# EAGLE design robocup-switcher board (EAGLE 4.16)
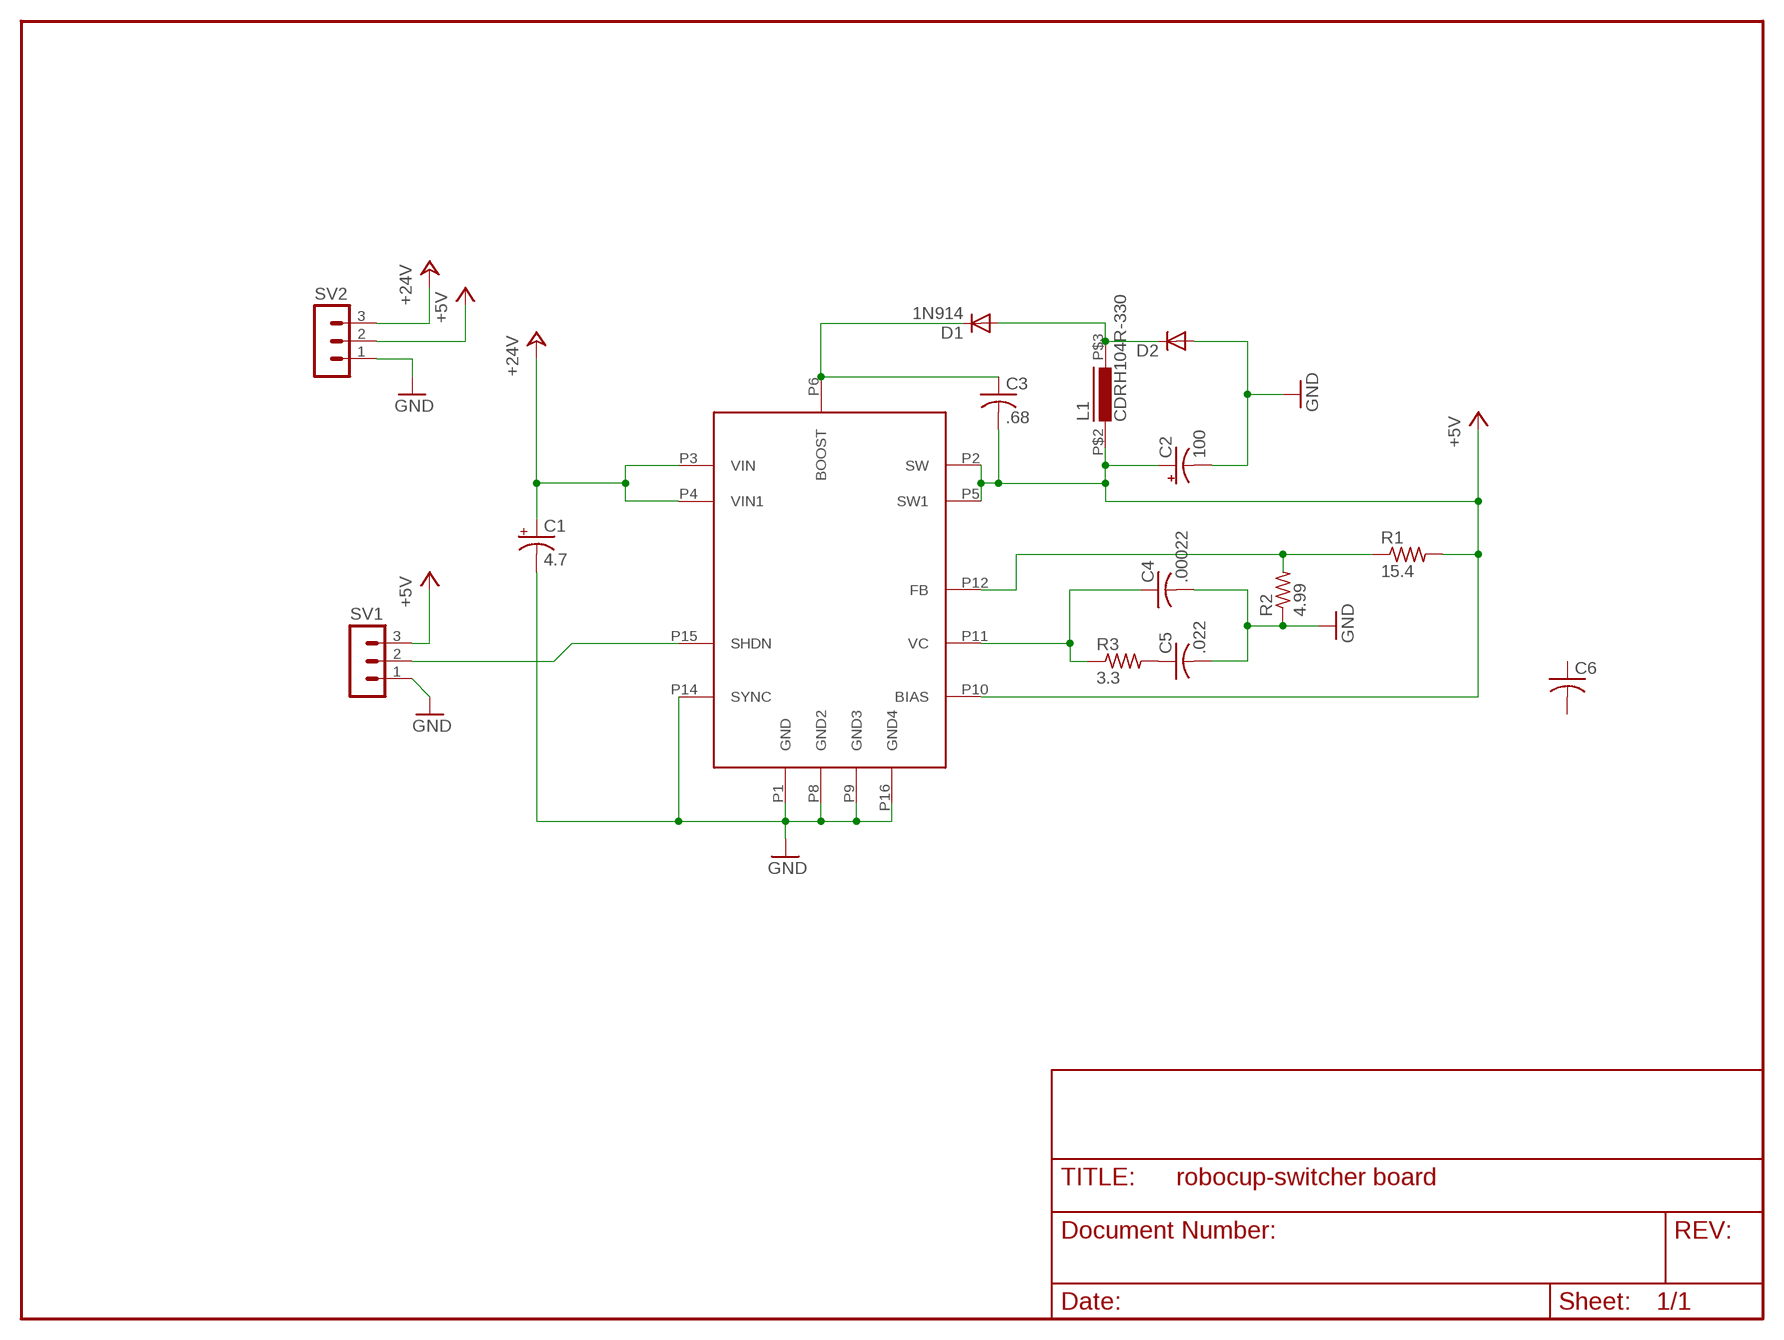
[diagram p0: schematic, sheet 1]

## Parts
C1  4.7  CPOL-USSMCD  [SMC_D]
C2  100  CPOL-USSMCD  [SMC_D]
C3  .68  C-USC0805  [C0805]
C4  .00022  C-USC0805  [C0805]
C5  .022  C-USC0805  [C0805]
C6  C-USC0805  [C0805]
D1  1N914  DIODE-MELF-MLL41  [MELF-MLL41]
D2  DIODE-SMC  [SMC]
L1  CDRH104R-330  [CDRH104]
R1  15.4  R-US_R0805  [R0805]
R2  4.99  R-US_R0805  [R0805]
R3  3.3  R-US_R0805  [R0805]
SV1  MA03-1  [MA03-1]
SV2  MA03-1  [MA03-1]
U$1  LT3430  [TSSOP16]

## Nets
+5V: C2.+ C3.2 L1.P$2 R1.2 SV1.3 SV2.2 U$1.P2(SW) U$1.P5(SW1) U$1.P10(BIAS)
+24V: C1.+ SV2.3 U$1.P3(VIN) U$1.P4(VIN1)
GND: C1.- C2.- C4.2 C5.2 D2.A R2.1 SV1.1 SV2.1 U$1.P1(GND) U$1.P8(GND2) U$1.P9(GND3) U$1.P14(SYNC) U$1.P16(GND4)
N$1: C3.1 D1.C U$1.P6(BOOST)
N$2: SV1.2 U$1.P15(SHDN)
N$3: R1.1 R2.2 U$1.P12(FB)
N$5: D1.A D2.C L1.P$3
N$6: C4.1 R3.1 U$1.P11(VC)
N$7: C5.1 R3.2
Unconnected: C6.1 C6.2

## Library data of the parts
C1 C2 = rcl:CPOL-US: POLARIZED CAPACITOR, American symbol
C3-C6 = rcl:C-US: CAPACITOR, American symbol
D1 D2 = diode:DIODE-: DIODE
L1 = inductors:CDRH104R-330
R1-R3 = rcl:R-US_: RESISTOR, American symbol
SV1 SV2 = con-lstb:MA03-1: PIN HEADER
U$1 = linear-technology:LT3430

## Board
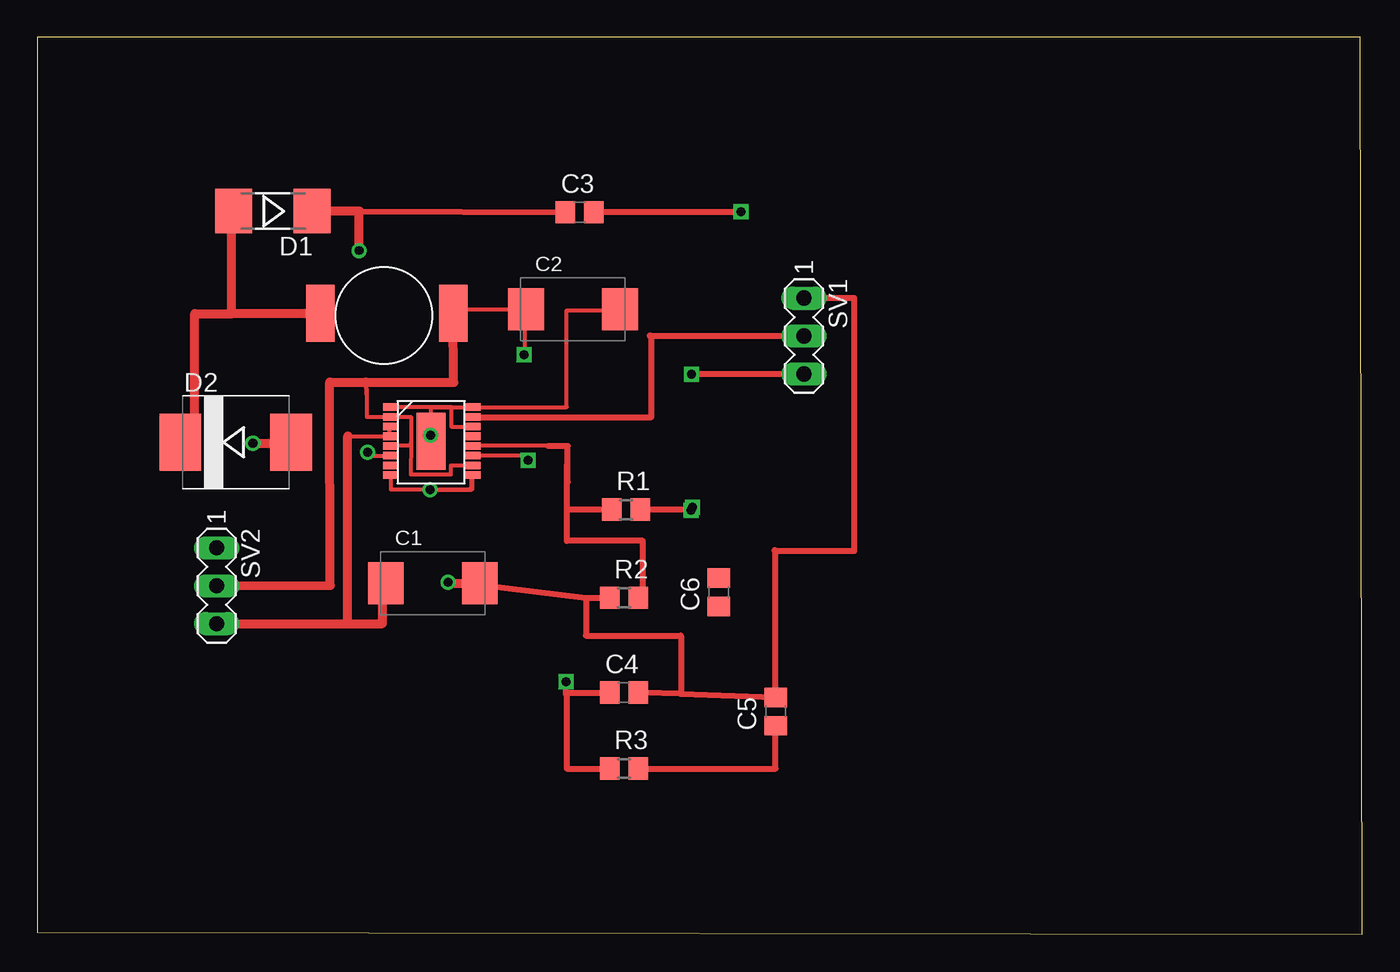
[diagram p1: board, top side]
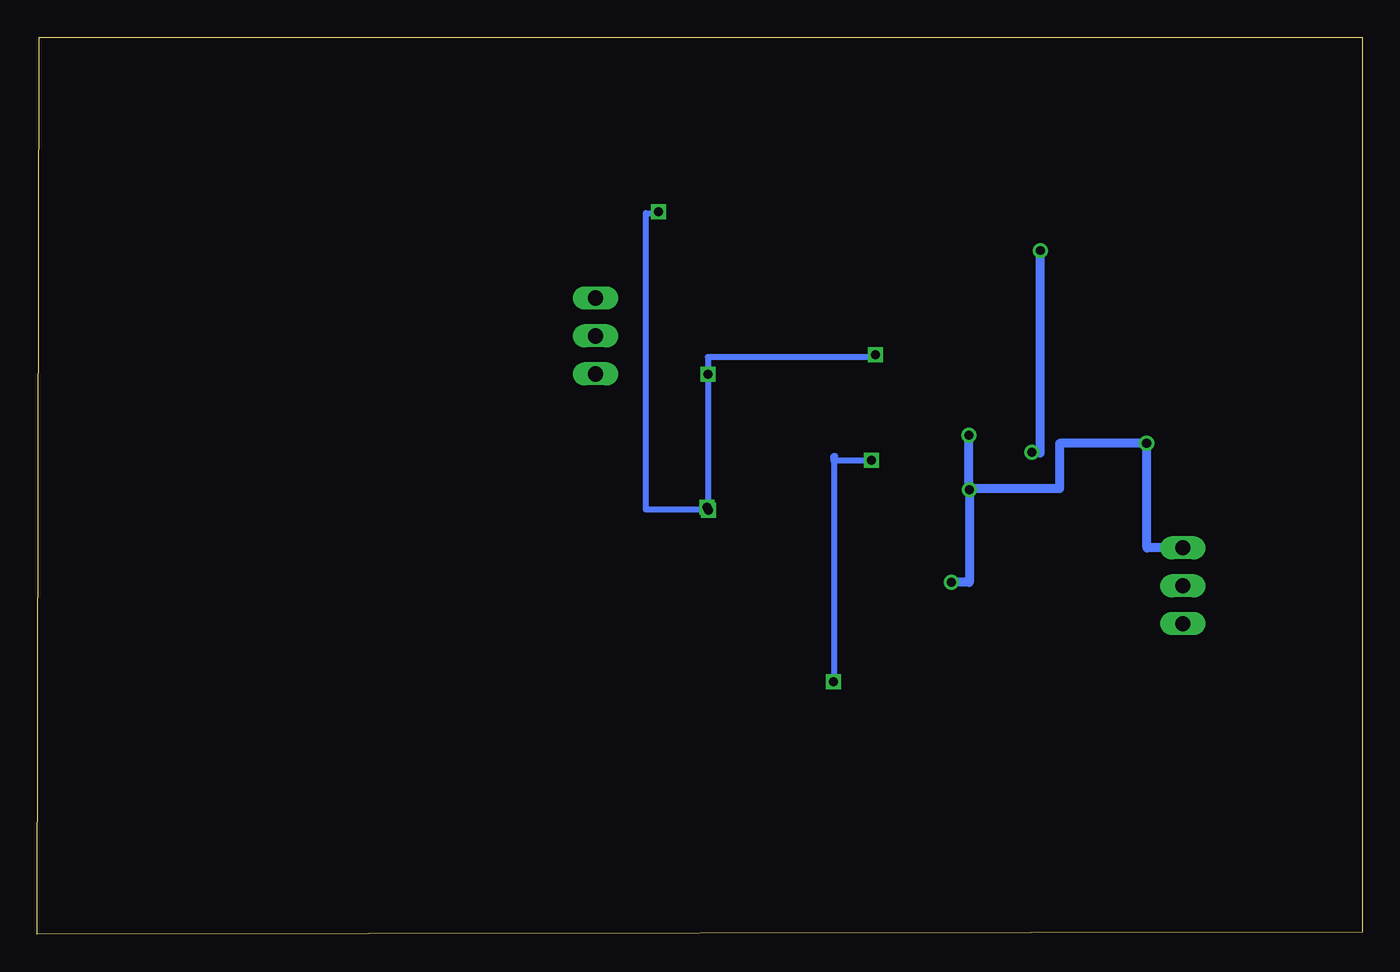
[diagram p2: board, bottom side, seen from below]

Size 88.74 x 60.05 mm. Coordinates in mm from the lower left corner, seen from the top.
Outline: 0,0.14 88.74,0 88.6,60.05 0,60.05 0,0.14
Copper layers (1*16): Top 0.035mm / dielectric 1.5mm / Bottom 0.035mm
Design rules "default": minimum track width 10mil, minimum drill 24mil, track to track 8mil, track to pad 8mil, pad to pad 8mil, via to via 8mil, smd to smd 8mil, copper to edge 40mil, drill to drill 8mil, minimum pad ring 10mil, minimum via ring 8mil, stop-mask expansion 4mil, vias tented up to drill 0mil, thermal gap 10mil

### Footprints (pad centres in the part's own frame; a part is rotated, then mirrored left to right if it is on the bottom)
SMC_D = smd 2.4 x 2.8: + -3.15,0; - 3.15,0
C0805 = smd 1.3 x 1.5: 1 -0.95,0; 2 0.95,0
MELF-MLL41 = smd 2.5 x 3: A 2.625,0; C -2.625,0
SMC = smd 2.8 x 3.8: A 3.7,0; C -3.7,0
CDRH104 = smd 3.81 x 1.93: P$2 -8.9,0; P$3 -8.9,8.9
R0805 = smd 1.3 x 1.5: 1 -0.95,0; 2 0.95,0
MA03-1 = drill 1.016 long: 1 -2.54,0; 2 0,0; 3 2.54,0
TSSOP16 = smd 0.508 x 1.016: P1 -2.6,-1.95; P2 -1.95,-1.95; P3 -1.3,-1.95; P4 -0.65,-1.95; P5 0,-1.95; P6 0.65,-1.95; P7 1.3,-1.95; P8 1.95,-1.95; P9 1.95,3.55; P10 1.3,3.55; P11 0.65,3.55; P12 0,3.55; P13 -0.65,3.55; P14 -1.3,3.55; P15 -1.95,3.55; P16 -2.6,3.55 | smd 3.81 x 1.93: P17 -0.316,0.746

### Placement (x,y rotation side)
C1  26.49,23.51 0 top
C2  35.88,41.84 0 top
C3  36.33,48.34 0 top
C4  39.29,16.18 0 top
C5  49.45,14.91 90 top
C6  45.64,22.9 90 top
D1  15.78,48.42 180 top
D2  13.29,32.94 0 top
L1  27.86,50.47 90 top
R1  39.43,28.43 0 top
R2  39.29,22.53 0 top
R3  39.29,11.1 0 top
SV1  51.36,40.06 270 top
SV2  12.01,23.33 270 top
U$1  25.63,32.69 270 top

### Tracks (layer width: path | path; a pad name or v marks a point on that pad's centre or on a via)
+5V  (via drill 0.6)
  Top 0.254: 25.03,32.93 25.03,34.64 U$1.P2 22.06,34.64 22.06,36.12 | 25.03,32.93 25.03,32.69 23.61,32.69 | 23.61,32.69 23.61,32.72 | 23.61,32.69 U$1.P5 | 22.06,36.12 22.02,36.95 | 27.86,41.6 L1.P$2 27.75,41.57 27.75,41.85 C2.+ 32.62,41.85 | U$1.P10 27.71,31.39 27.71,30.79 25.01,30.79 25.02,32.93 25.03,32.93 | 22.06,36.12 22.06,36.14 22.01,36.96 | 32.62,41.85 | 32.62,41.85 32.62,38.79
  Top 0.406: 43.86,28.44 R1.2 | 43.86,28.44 43.86,28.46 v43.79,28.39 | 43.86,28.44 43.87,28.44 v43.87,28.58 | C3.2 47.12,48.34 v47.12,48.39 | 32.61,38.79 32.61,38.75 | 32.62,38.79 32.61,38.79 | 32.61,38.79 v32.61,38.81 | 43.82,37.52 SV1.3 | 43.82,37.52 43.82,37.54 | v43.82,37.48 43.82,37.52
  Top 0.61: 22.02,36.95 27.88,36.95 L1.P$2 | SV2.2 19.63,23.35 19.59,36.96 22.01,36.96
  Bottom 0.406: v47.12,48.39 47.33,48.39 47.33,48.28 47.97,48.28 47.97,28.43 43.84,28.43 43.84,28.39 v43.79,28.39 43.82,28.39 v43.82,37.48 43.82,38.65 32.61,38.65 v32.61,38.81
+24V
  Top 0.254: 23.12,23.63 23.12,23.51 C1.+ | U$1.P3 23.6,33.99 23.6,33.34 U$1.P4 20.8,33.36 | 20.8,20.81 20.41,20.79
  Top 0.61: SV2.3 20.8,20.81 | 20.8,20.81 23.12,20.79 23.12,23.51 | 20.8,20.81 20.8,33.36
GND  (via drill 0.6)
  Top 0.254: U$1.P9 29.12,30.74 29.12,29.77 23.68,29.77 U$1.P8 | U$1.P9 | 26.36,35.29 U$1.P1 | 26.36,35.29 27.73,35.29 | 27.73,35.29 26.45,35.29 | 27.73,35.29 U$1.P16 35.45,35.29 35.45,41.78 39.08,41.78 39.08,41.85 | U$1.P14 27.73,33.99 27.73,35.29 | U$1.P9 29.1,30.74 29.1,29.89 | 29.1,29.89 29.1,29.76 v26.31,29.76 | v26.34,33.41 26.36,33.41 26.36,35.29 | D2.A 14.45,32.85 v14.45,32.87 v14.42,32.87 | 29.1,29.89 29.05,29.89 | 39.08,41.85 39.08,41.91 | 39.08,41.85 C2.- | v27.53,23.56 27.53,23.51
  Top 0.406: 36.75,22.53 R2.1 | C4.2 40.56,16.18 43.1,16.09 | 43.1,16.09 C5.2 49.45,25.67 49.38,25.67 | 36.75,22.53 36.75,19.99 43.1,19.99 43.1,16.18 43.1,16.09 | C1.- 29.66,23.41 36.75,22.53 | SV1.1 54.72,42.6 54.72,25.67 49.38,25.67 | 49.38,25.67 49.38,25.72
  Top 0.61: 17.81,32.84 17.81,32.85 D2.A | 17.81,32.84 14.53,32.84 | 17.81,32.84 17.81,32.8 | 27.53,23.51 C1.-
  Bottom 0.254: v26.31,29.76 26.34,29.82 | 26.41,29.76 26.41,29.71 | 26.41,29.76 v26.31,29.76 | 26.41,29.83 26.41,29.76 | 26.32,29.8 26.32,29.76 v26.31,29.76
  Bottom 0.61: 26.34,29.82 v26.34,33.41 | v14.45,32.87 20.28,32.87 20.28,29.83 26.41,29.83 | SV2.1 14.42,25.87 v14.42,32.87 | v27.53,23.56 26.32,23.56 26.32,29.76
N$1  (via drill 0.6)
  Top 0.254: U$1.P6 22.11,32.04 v22.12,32.26
  Top 0.406: 21.56,48.42 C3.1
  Top 0.61: D1.C 21.56,48.42 v21.56,45.78
  Bottom 0.254: v22.12,32.26 21.56,32.22
  Bottom 0.61: 21.56,32.22 v21.56,45.78
N$2
  Top 0.406: U$1.P15 29.49,34.64 29.49,34.62 41.12,34.62 41.12,40.06 41.02,40.06 | 41.02,40.06 SV1.2 | 41.02,40.06 41.02,40.08
N$3
  Top 0.254: 34.22,32.69 34.22,32.66 | 34.21,32.69 34.22,32.69 | U$1.P12 34.22,32.69
  Top 0.406: 35.48,28.44 35.48,26.34 40.56,26.34 40.56,22.53 R2.2 | 35.48,28.44 35.48,30.28 | 35.48,30.28 35.48,31.42 | R1.1 37.69,28.44 35.48,28.44 | 35.48,30.28 35.52,30.28 35.52,32.69 34.21,32.69
N$5
  Top 0.61: D1.A 13.03,48.42 13.03,41.6 | L1.P$3 13.03,41.57 13.03,41.6 | D2.C 10.55,32.85 10.55,41.56 13.07,41.56 13.07,41.6 13.03,41.6
N$6  (via drill 0.6)
  Top 0.254: 32.85,31.73 32.85,31.63 | v32.88,31.73 32.85,31.73 | U$1.P11 32.85,32.04 32.85,31.73
  Top 0.406: C4.1 35.48,16.18 35.48,16.02 | 35.48,16.02 35.48,11.1 R3.1 | 35.48,16.02 35.42,16.02 v35.42,16.92
  Bottom 0.406: v35.42,16.92 35.36,16.92 35.36,31.73 | 35.36,31.73 v32.88,31.73 | 35.41,31.73 35.41,32.04 35.3,32.04 | 35.36,31.73 35.41,31.73 | 35.41,31.73 35.41,31.66
N$7
  Top 0.406: R3.2 49.45,11.1 C5.1